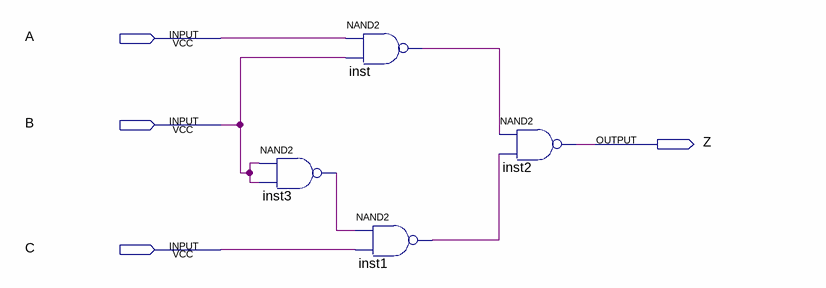
[diagram p0: schematic sheet]
// Quartus schematic ECE385_Lab_01.bdf as structural Verilog: 4 symbols, 4 pins
module ECE385_Lab_01 (
  input  A,
  input  B,
  input  C,
  output Z
);

  wire inst1_out, inst3_out, inst_out;

  nand inst3 (inst3_out, B, B);
  nand inst (inst_out, A, B);
  nand inst1 (inst1_out, inst3_out, C);
  nand inst2 (Z, inst_out, inst1_out);
endmodule
